# Altium schematic sheet CAN_Tranceiver.SchDoc
size A
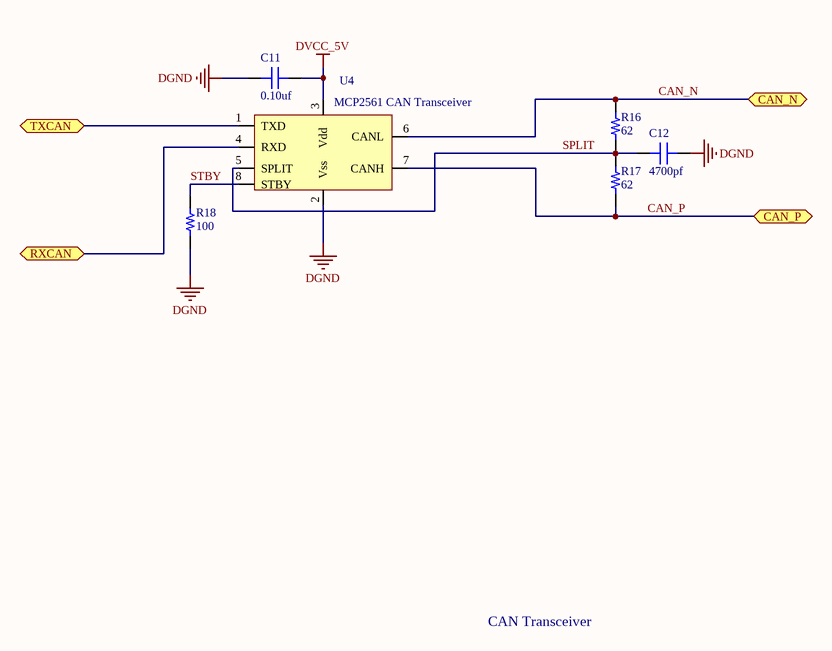
[diagram p0: CAN_Tranceiver.SchDoc]

## Parts
C11  value 0.10uf  [CAP 0603/1608]  (hidden comment: Capacitor MLCC 0.10uf 50V CAP 0603/1608)
C12  value 4700pf  [CAP 0603/1608]  (hidden comment: Capacitor MLCC 4700pf 50V CAP 0603/1608)
R16  value 62  [RES 0603/1608]  (hidden comment: Resistor 62 0603 1/10W 5%)
R17  value 62  [RES 0603/1608]  (hidden comment: Resistor 62 0603 1/10W 5%)
R18  value 100  [RES 0603/1608]  (hidden comment: Resistor 100 0603 1/10W 10%)
U4  MCP2561 CAN Transceiver  [SOIC-8]

## Ports
CAN_N (bidir), CAN_P (bidir), RXCAN (bidir), TXCAN (bidir)

## Nets
DGND: C11.1 C12.1 R18.1 U4.2(Vss)
DVCC_5V: C11.2 U4.3(Vdd)
CAN_N: R16.1 U4.6(CANL) ; port CAN_N
CAN_P: R17.2 U4.7(CANH) ; port CAN_P
RXCAN: U4.4(RXD) ; port RXCAN
SPLIT: C12.2 R16.2 R17.1 U4.5(SPLIT)
STBY: R18.2 U4.8(STBY)
TXCAN: U4.1(TXD) ; port TXCAN

## Notes on the sheet
- CAN Transceiver

## Library data of the parts
C11 = 943: Manufacturer_id: 1; idCapacitor: 943; Name: Cap_0.10uf_50V_CAP 0603/1608; Dielectric: Ceramic; Created_By: Nick Mah; Drawer_id: 1; Voltage_Rating: 50V; Package: CAP 0603/1608; Created_Date: 10/20/2018
C12 = 929: Manufacturer_id: 1; idCapacitor: 929; Name: Cap_4700pf_50V_CAP 0603/1608; Dielectric: Ceramic; Created_By: Nick Mah; Drawer_id: 1; Voltage_Rating: 50V; Package: CAP 0603/1608; Created_Date: 10/20/2018
R16 R17 = 1340: Manufacturer_id: 1; idResistor: 1340; Name: Res_62_0603_1/10W_5%; Created_By: Nick Mah; Supplier 1: Digi-Key; Drawer_id: 1; Tolerance: 5%; Power: 1/10W; Package: 0603; ComponentLink1Description: Datasheet; Created_Date: 2018-10-20
R18 = 2293: Manufacturer_id: 1; idResistor: 2293; Name: Res_100_0603_1/10W_10%; Created_By: Nick Mah; Supplier 1: Digi-Key; Drawer_id: 1; Tolerance: 10%; Power: 1/10W; Package: 0603; ComponentLink1Description: Datasheet; Created_Date: 2018-10-20
U4 = 5: Manufacturer_id: 1; idIC_Interface: 5; Value: CAN/UART; Data_Rate: 1Mbps; Vin(Min): 4.5V; Vin(Max): 5.5V; Created_By: Angel Delgado; Drawer_id: 1; Name: CAN Transceiver; Type: Transceiver; Protocol: CAN; Num_Circuits: 1; Package: SOIC-8; MfrPartNo: MCP2561; Link: https://www.digikey.com/product-detail/en/microchip-technology/MCP2561T-E-SN/MCP2561T-E-SNCT-ND/5148846